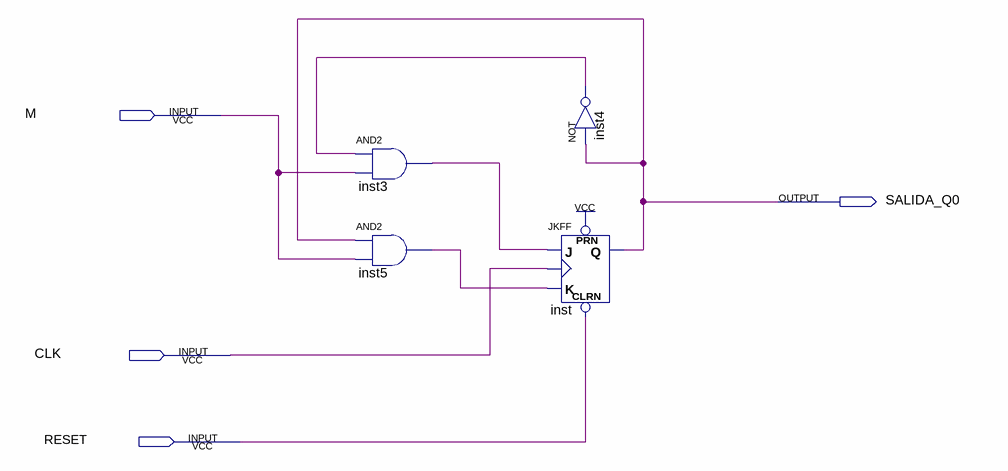
[diagram p0: schematic sheet]
// Quartus schematic FLIPFLOP_JK0.bdf as structural Verilog: 4 symbols, 4 pins
module FLIPFLOP_JK0 (
  input  M,
  input  CLK,
  input  RESET,
  output SALIDA_Q0
);

  wire inst3_out, inst4_out, inst5_out;

  and inst3 (inst3_out, inst4_out, M);
  and inst5 (inst5_out, SALIDA_Q0, M);
  not inst4 (inst4_out, SALIDA_Q0);
  JKFF inst (.PRN(1'b1), .CLRN(RESET), .K(inst5_out), .J(inst3_out), .CLK(CLK), .Q(SALIDA_Q0));
endmodule
